# EAGLE design RTC (EAGLE 7.2.0)
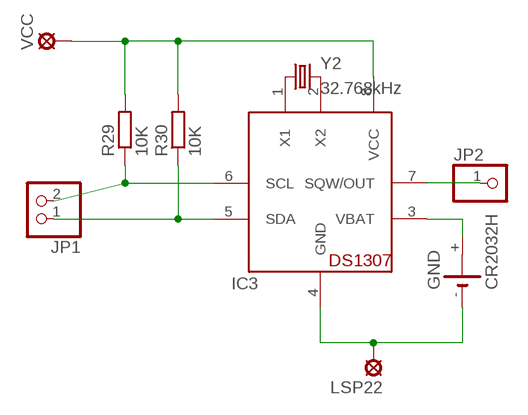
[diagram p0: schematic, sheet 1]

## Parts
GND  CR2032H  [CR2032H]
IC3  DS1307  [DIL08]
JP1  PINHD-1X2  [1X02]
JP2  PINHD-1X1  [1X01]
LSP22  LSP10  [LSP10]
R29  10K  R-EU_0207/10  [0207/10]
R30  10K  R-EU_0207/10  [0207/10]
VCC  LSP10  [LSP10]
Y2  32.768kHz  CRYSTALTC26V  [TC26V]

## Nets
N$113: IC3.6(SCL) JP1.2 R29.1
N$114: IC3.5(SDA) JP1.1 R30.1
N$115: IC3.8(VCC) R29.2 R30.2 VCC.MP
N$116: IC3.7(SQW/OUT) JP2.1
N$117: GND.+ IC3.3(VBAT)
N$120: IC3.1(X1) Y2.1
N$121: IC3.2(X2) Y2.2
N$127: GND.- IC3.4(GND) LSP22.MP
Unconnected: GND.+@1(+)

## Library data of the parts
GND = battery:CR2032H: LI BATTERY Varta
IC3 = adafruit:DS1307: DS1307 Real time clock (RTC) with battery backup ability. Talk to it via i2c
JP1 = pinhead:PINHD-1X2: PIN HEADER
JP2 = pinhead:PINHD-1X1: PIN HEADER
LSP22 VCC = solpad:LSP10: SOLDER PAD drill 1.0 mm, distributor Buerklin, 12H555
R29 R30 = resistor:R-EU_: RESISTOR, European symbol
Y2 = adafruit:CRYSTAL: CRYSTAL; OC_FARNELL: unknown; OC_NEWARK: unknown

## Board
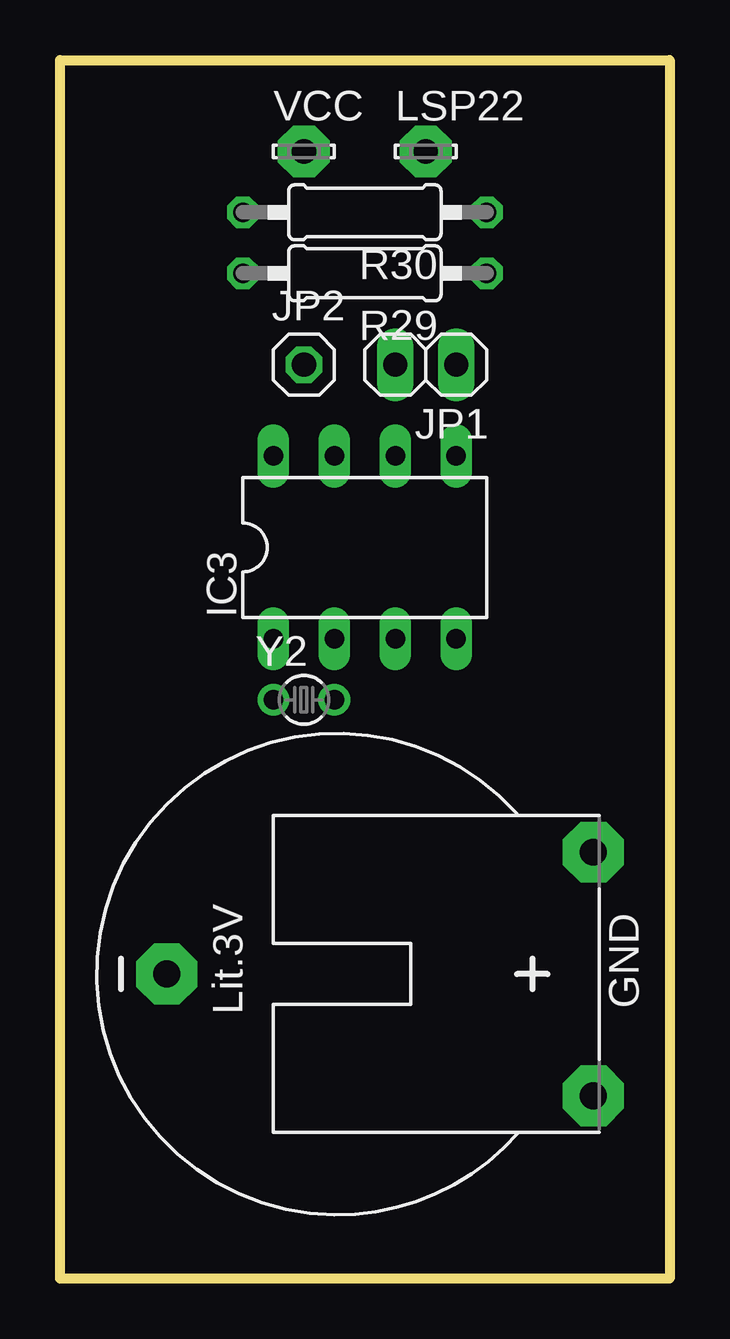
[diagram p1: board, top side]
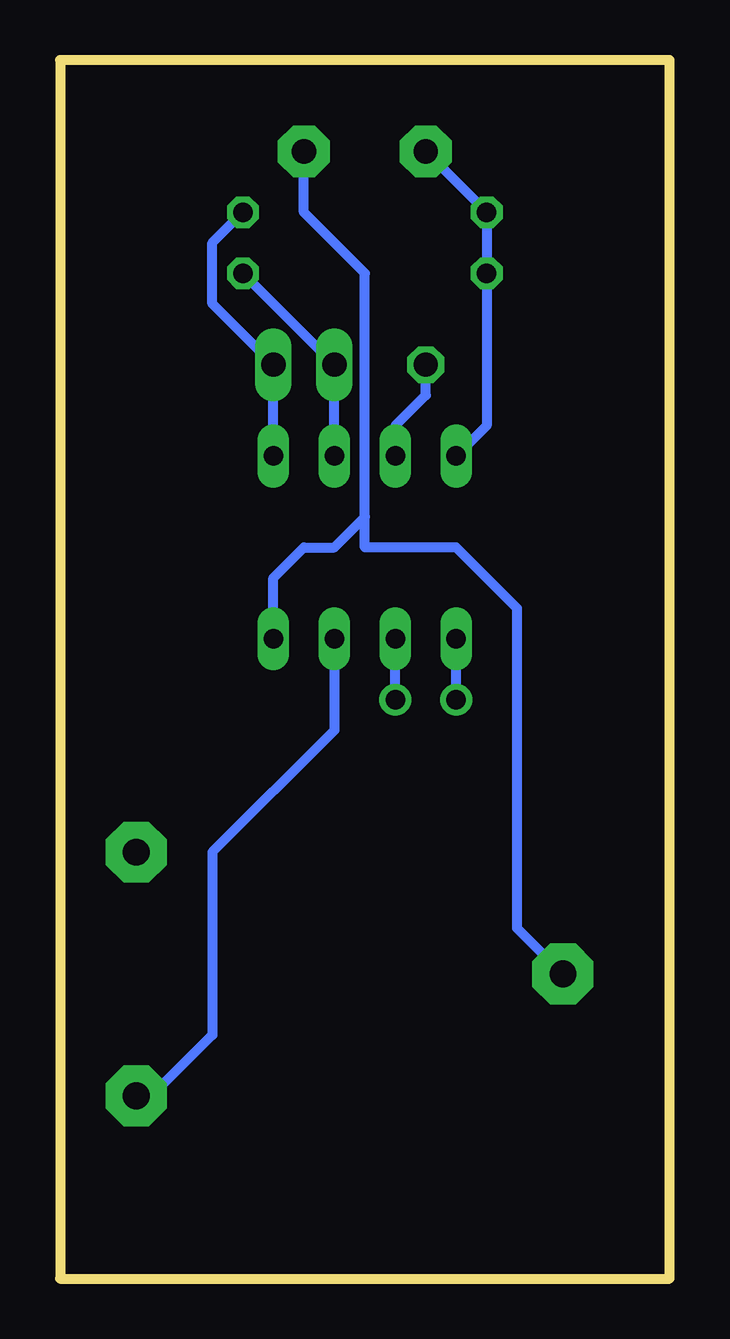
[diagram p2: board, bottom side, seen from below]

Size 25.4 x 50.8 mm. Coordinates in mm from the lower left corner, seen from the top.
Outline: 0,0 0,50.8 25.4,50.8 25.4,0 0,0
Copper layers (1*16): Top 0.035mm / dielectric 1.5mm / Bottom 0.035mm
Design rules "default": minimum track width 10mil, minimum drill 24mil, track to track 8mil, track to pad 8mil, pad to pad 8mil, via to via 8mil, smd to smd 8mil, copper to edge 40mil, drill to drill 8mil, minimum pad ring 10mil, minimum via ring 8mil, stop-mask expansion 4mil, vias tented up to drill 0mil, thermal gap 10mil

### Footprints (pad centres in the part's own frame; a part is rotated, then mirrored left to right if it is on the bottom)
CR2032H = drill 1.118 pad 2.54 octagon: + 5.08,10.795; +@1 -5.08,10.795; - 0,-6.985
DIL08 = drill 0.813 long: 1 -3.81,-3.81; 2 -1.27,-3.81; 3 1.27,-3.81; 4 3.81,-3.81; 5 3.81,3.81; 6 1.27,3.81; 7 -1.27,3.81; 8 -3.81,3.81
1X02 = drill 1.016 long: 1 -1.27,0; 2 1.27,0
1X01 = drill 1.016 octagon: 1 0,0
LSP10 = drill 1.016 pad 2.159 octagon: MP 0,0
0207/10 = drill 0.813 octagon: 1 -5.08,0; 2 5.08,0
TC26V = drill 0.813: 1 -1.27,0; 2 1.27,0

### Placement (x,y rotation side)
GND  11.43,12.7 270 top
IC3  12.7,30.48 0 top
JP1  15.24,38.1 180 top
JP2  10.16,38.1 0 top
LSP22  15.24,46.99 0 top
R29  12.7,41.91 180 top
R30  12.7,44.45 180 top
VCC  10.16,46.99 0 top
Y2  10.16,24.13 0 top

### Tracks (layer width: path | path; a pad name or v marks a point on that pad's centre or on a via)
N$113
  Bottom 0.406: IC3.6 JP1.2 R29.1
N$114
  Bottom 0.406: IC3.5 JP1.1 19.05,40.64 19.05,43.18 R30.1
N$115
  Bottom 0.406: VCC.MP R30.2 R29.2 7.62,35.56 IC3.8
N$116
  Bottom 0.406: IC3.7 11.43,35.56 10.16,36.83 JP2.1
N$117
  Bottom 0.406: IC3.3 13.97,22.86 19.05,17.78 19.05,10.16 21.59,7.62 GND.+
N$120
  Bottom 0.406: Y2.1 IC3.1
N$121
  Bottom 0.406: Y2.2 IC3.2
N$127
  Bottom 0.406: IC3.4 16.51,29.21 15.24,30.48 13.97,30.48 12.7,31.75 | 12.7,31.75 12.7,41.91 15.24,44.45 LSP22.MP | GND.- 6.35,14.6 6.35,27.94 8.89,30.48 12.7,30.48 12.7,31.75